# Altium project Group37.PrjPcb
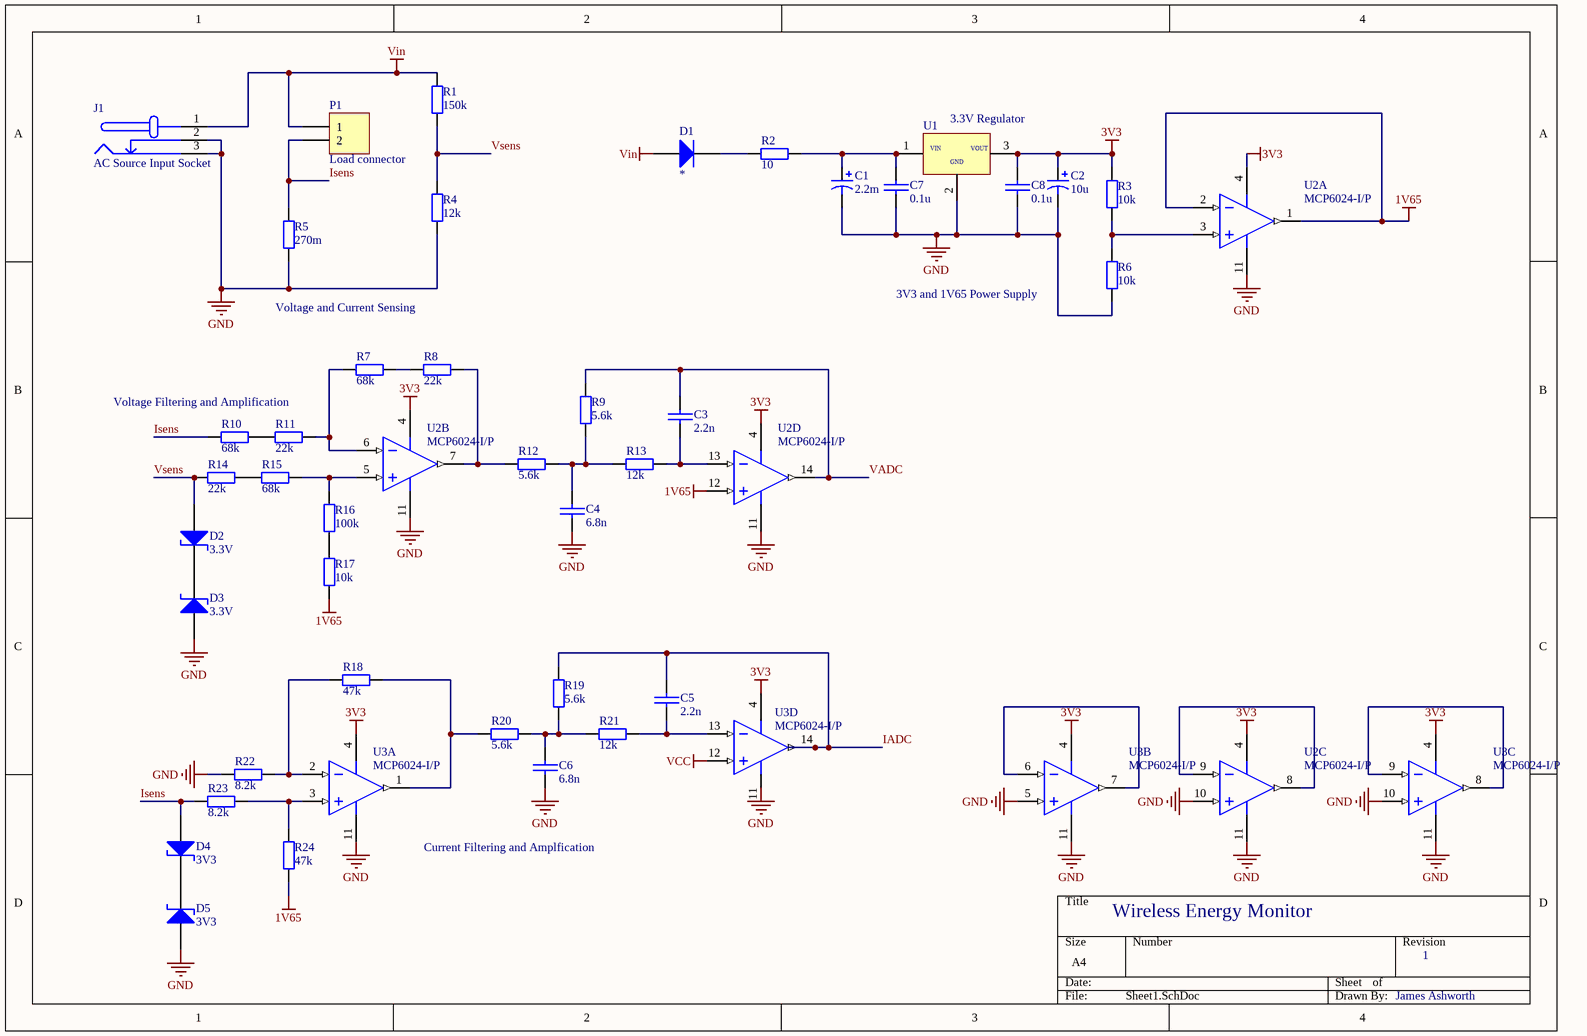
[diagram p0: Sheet1.SchDoc]
1 sheet, 42 parts. Net scope: global (net labels, ports and power ports of the same name join across sheets).
Board file: PCB1.PcbDoc

## Sheet Sheet1.SchDoc
size A4

### Parts
C1  2.2m  [CAP-RAD-7.5mm Pitch]
C2  10u  [CAP-RAD-3mm Pitch]
C3  2.2n  [ECE-CAPR0.2x0.1TH]
C4  6.8n  [ECE-CAPR0.2x0.1TH]
C5  2.2n  [ECE-CAPR0.2x0.1TH]
C6  6.8n  [ECE-CAPR0.2x0.1TH]
C7  0.1u  [ECE-CAPR0.2x0.1TH]
C8  0.1u  [ECE-CAPR0.2x0.1TH]
D1  *  [AXIAL-DIODE-0.4]
D2  3.3V  [AXIAL-DIODE-0.4]
D3  3.3V  [AXIAL-DIODE-0.4]
D4  3V3  [AXIAL-DIODE-0.4]
D5  3V3  [AXIAL-DIODE-0.4]
J1  AC Source Input Socket  [AC-Socket]
P1  Load connector  [Dual Banana Plug]
R1  150k  [AXIAL-0.4]
R2  10  [AXIAL-0.4]
R3  10k  [AXIAL-0.4]
R4  12k  [AXIAL-0.4]
R5  270m  [0805 RES]
R6  10k  [AXIAL-0.4]
R7  68k  [AXIAL-0.4]
R8  22k  [AXIAL-0.4]
R9  5.6k  [0805 RES]
R10  68k  [AXIAL-0.4]
R11  22k  [AXIAL-0.4]
R12  5.6k  [AXIAL-0.4]
R13  12k  [0805 RES]
R14  22k  [AXIAL-0.4]
R15  68k  [AXIAL-0.4]
R16  100k  [AXIAL-0.4]
R17  10k  [AXIAL-0.4]
R18  47k  [AXIAL-0.4]
R19  5.6k  [AXIAL-0.4]
R20  5.6k  [AXIAL-0.4]
R21  12k  [AXIAL-0.4]
R22  8.2k  [AXIAL-0.4]
R23  8.2k  [AXIAL-0.4]
R24  47k  [AXIAL-0.4]
U1  3.3V Regulator  [TO-92]
U2  MCP6024-I/P  [DIP-14]  (parts A,B,C,D of 4)
U3  MCP6024-I/P  [DIP-14]  (parts A,B,C,D of 4)

### Nets
1V65: R17.1 R24.1 U2.1(VOUTA) U2.2(VINA-) U2.12(VIND+)
3V3: C2.1 C8.1 R3.2 U1.3(OUTPUT) U2.4(VDD) U3.4(VDD)
GND: C1.2 C2.2 C4.2 C6.2 C7.2 C8.2 D3.1(A) D5.1(A) J1.2(GND_ALT) J1.3(GND) R4.1 R5.1 R6.1 R22.1 U1.2(GND) U2.10(VINC+) U2.11(VSS) U3.5(VINB+) U3.10(VINC+) U3.11(VSS)
VCC: U3.12(VIND+)
Vin: D1.1(A) J1.1(VCC) P1.1 R1.2
IADC: C5.1 R19.1 U3.14(VOUTD)
Isens: D4.1(A) P1.2 R5.2 R10.1 R23.1
VADC: C3.1 R9.2 U2.14(VOUTD)
Vsens: D2.1(A) R1.1 R4.2 R14.1
NetC1_1: C1.1 C7.1 R2.2 U1.1(INPUT)
NetC3_2: C3.2 R13.1 U2.13(VIND-)
NetC4_1: C4.1 R9.1 R12.2 R13.2
NetC5_2: C5.2 R21.1 U3.13(VIND-)
NetC6_1: C6.1 R19.2 R20.1 R21.2
NetD1_2: D1.2(K) R2.1
NetD2_2: D2.2(K) D3.2(K)
NetD4_2: D4.2(K) D5.2(K)
NetR3_1: R3.1 R6.2 U2.3(VINA+)
NetR7_1: R7.1 R11.2 U2.6(VINB-)
NetR7_2: R7.2 R8.1
NetR8_2: R8.2 R12.1 U2.7(VOUTB)
NetR10_2: R10.2 R11.1
NetR14_2: R14.2 R15.1
NetR15_2: R15.2 R16.2 U2.5(VINB+)
NetR16_1: R16.1 R17.2
NetR18_1: R18.1 R20.2 U3.1(VOUTA)
NetR18_2: R18.2 R22.2 U3.2(VINA-)
NetR23_2: R23.2 R24.2 U3.3(VINA+)
NetU2_8: U2.8(VOUTC) U2.9(VINC-)
NetU3_6: U3.6(VINB-) U3.7(VOUTB)
NetU3_8: U3.8(VOUTC) U3.9(VINC-)

### Notes on the sheet
- Voltage and Current Sensing
- 3V3 and 1V65 Power Supply
- Voltage Filtering and Amplification
- Current Filtering and Amplfication
- Wireless Energy Monitor
- 1
- James Ashworth
- Labels drawn without touching a wire or pin: GND
- (in symbol LP2950-33) VIN; VOUT

### Library data of the parts
C1 = Cap Pol (220uF-470uF): Polarized Capacitor (Axial); Published: 8-Jun-2000; LatestRevisionDate: 17-Jul-2002; LatestRevisionNote: Re-released for DXP Platform.; PackageReference: POLAR0.8; Publisher: Altium Limited; PackageDescription: Polarized Capacitor; 2 Leads; Value: *
C2 = Cap Pol (22uF-100uF): Polarized Capacitor (Axial); Published: 8-Jun-2000; LatestRevisionDate: 17-Jul-2002; LatestRevisionNote: Re-released for DXP Platform.; PackageReference: POLAR0.8; Publisher: Altium Limited; PackageDescription: Polarized Capacitor; 2 Leads; Value: *
C3-C8 = CAP000001: CAP CER 10pF 50V TH; Manufactuer: TDK; Manufacturer-PN: FK28C0G1H100D; Assembly Method: Through hole; Item Type: Item; Path: ece/ts/Lists/Stock Inventory; UoA Stock#: CAP000001; Value: 10pF; Size/Package: Radial; Voltage/Current: 50V; Datasheet Link: http://share.engineering.auckland.ac.nz/ece/ts/Student%20Documents/CER%20CAP.pdf; Supplier1: Electus; Supplier1-PN: RC5312; Component Type: NA; Category: Capacitor; Review-date: 41972; Status: Active
D1 = Diode: Manufacturer: Fairchild Semiconductor; Revision 1: 11-July-2000: SIM Model Added.; Revision 2: July-2002: Re-released for DXP Platform.; Class I: Discrete; Class II: Diode - Switching; Published: 8-Jun-2000; Datasheet: Latest Revision: 1997; Package Reference: DO-35; Publisher: Altium Limited; Value: *
D2-D5 = Zener: Zener Diode; Value: *
J1 = AC Input: Value: socket
P1 = Dual Banana Plugs: M6 Holes; LatestRevisionDate: 17-Jul-2002; LatestRevisionNote: Re-released for DXP Platform.; Publisher: Altium Limited
R1-R24 = Res: Through Hole Resistor; Published: 8-Jun-2000; LatestRevisionDate: 17-Jul-2002; LatestRevisionNote: Re-released for DXP Platform.; PackageReference: AXIAL-0.4; Publisher: Altium Limited; Value: *
U1 = LP2950-33
U2 U3 = MCP6024-I/P: Rail-to-Rail Input/Output, 10 MHz Operational Amplifier, 14-Pin PDIP, Industrial Temperature; FirstPublished: 29-Jan-2009; LatestRevisionDate: 02-Dec-2009; LatestRevisionNote: Updated to datasheet revision D, Feb-2009; DatasheetVersion: revD, Feb-2009; PackageVersion: revBB, Aug-2009; PackageReference: PDIP300-P14; Publisher: Altium Limited; PackageDescription: 14-Lead Plastic Dual In-Line (P) - 300 mil Body [PDIP]; ComponentLink1Description: Datasheet; ComponentLink1URL: http://ww1.microchip.com/downloads/en/DeviceDoc/21685d.pdf; ComponentLink2Description: Packaging Specification; ComponentLink2URL: http://www.microchip.com/stellent/groups/techpub_sg/documents/packagingspec/en012702.pdf; ComponentLink3Description: Microchip.com Home; ComponentLink3URL: http://www.microchip.com/